# EAGLE design Adafruit QT Py ESP32 Pico (EAGLE 9.6.2)
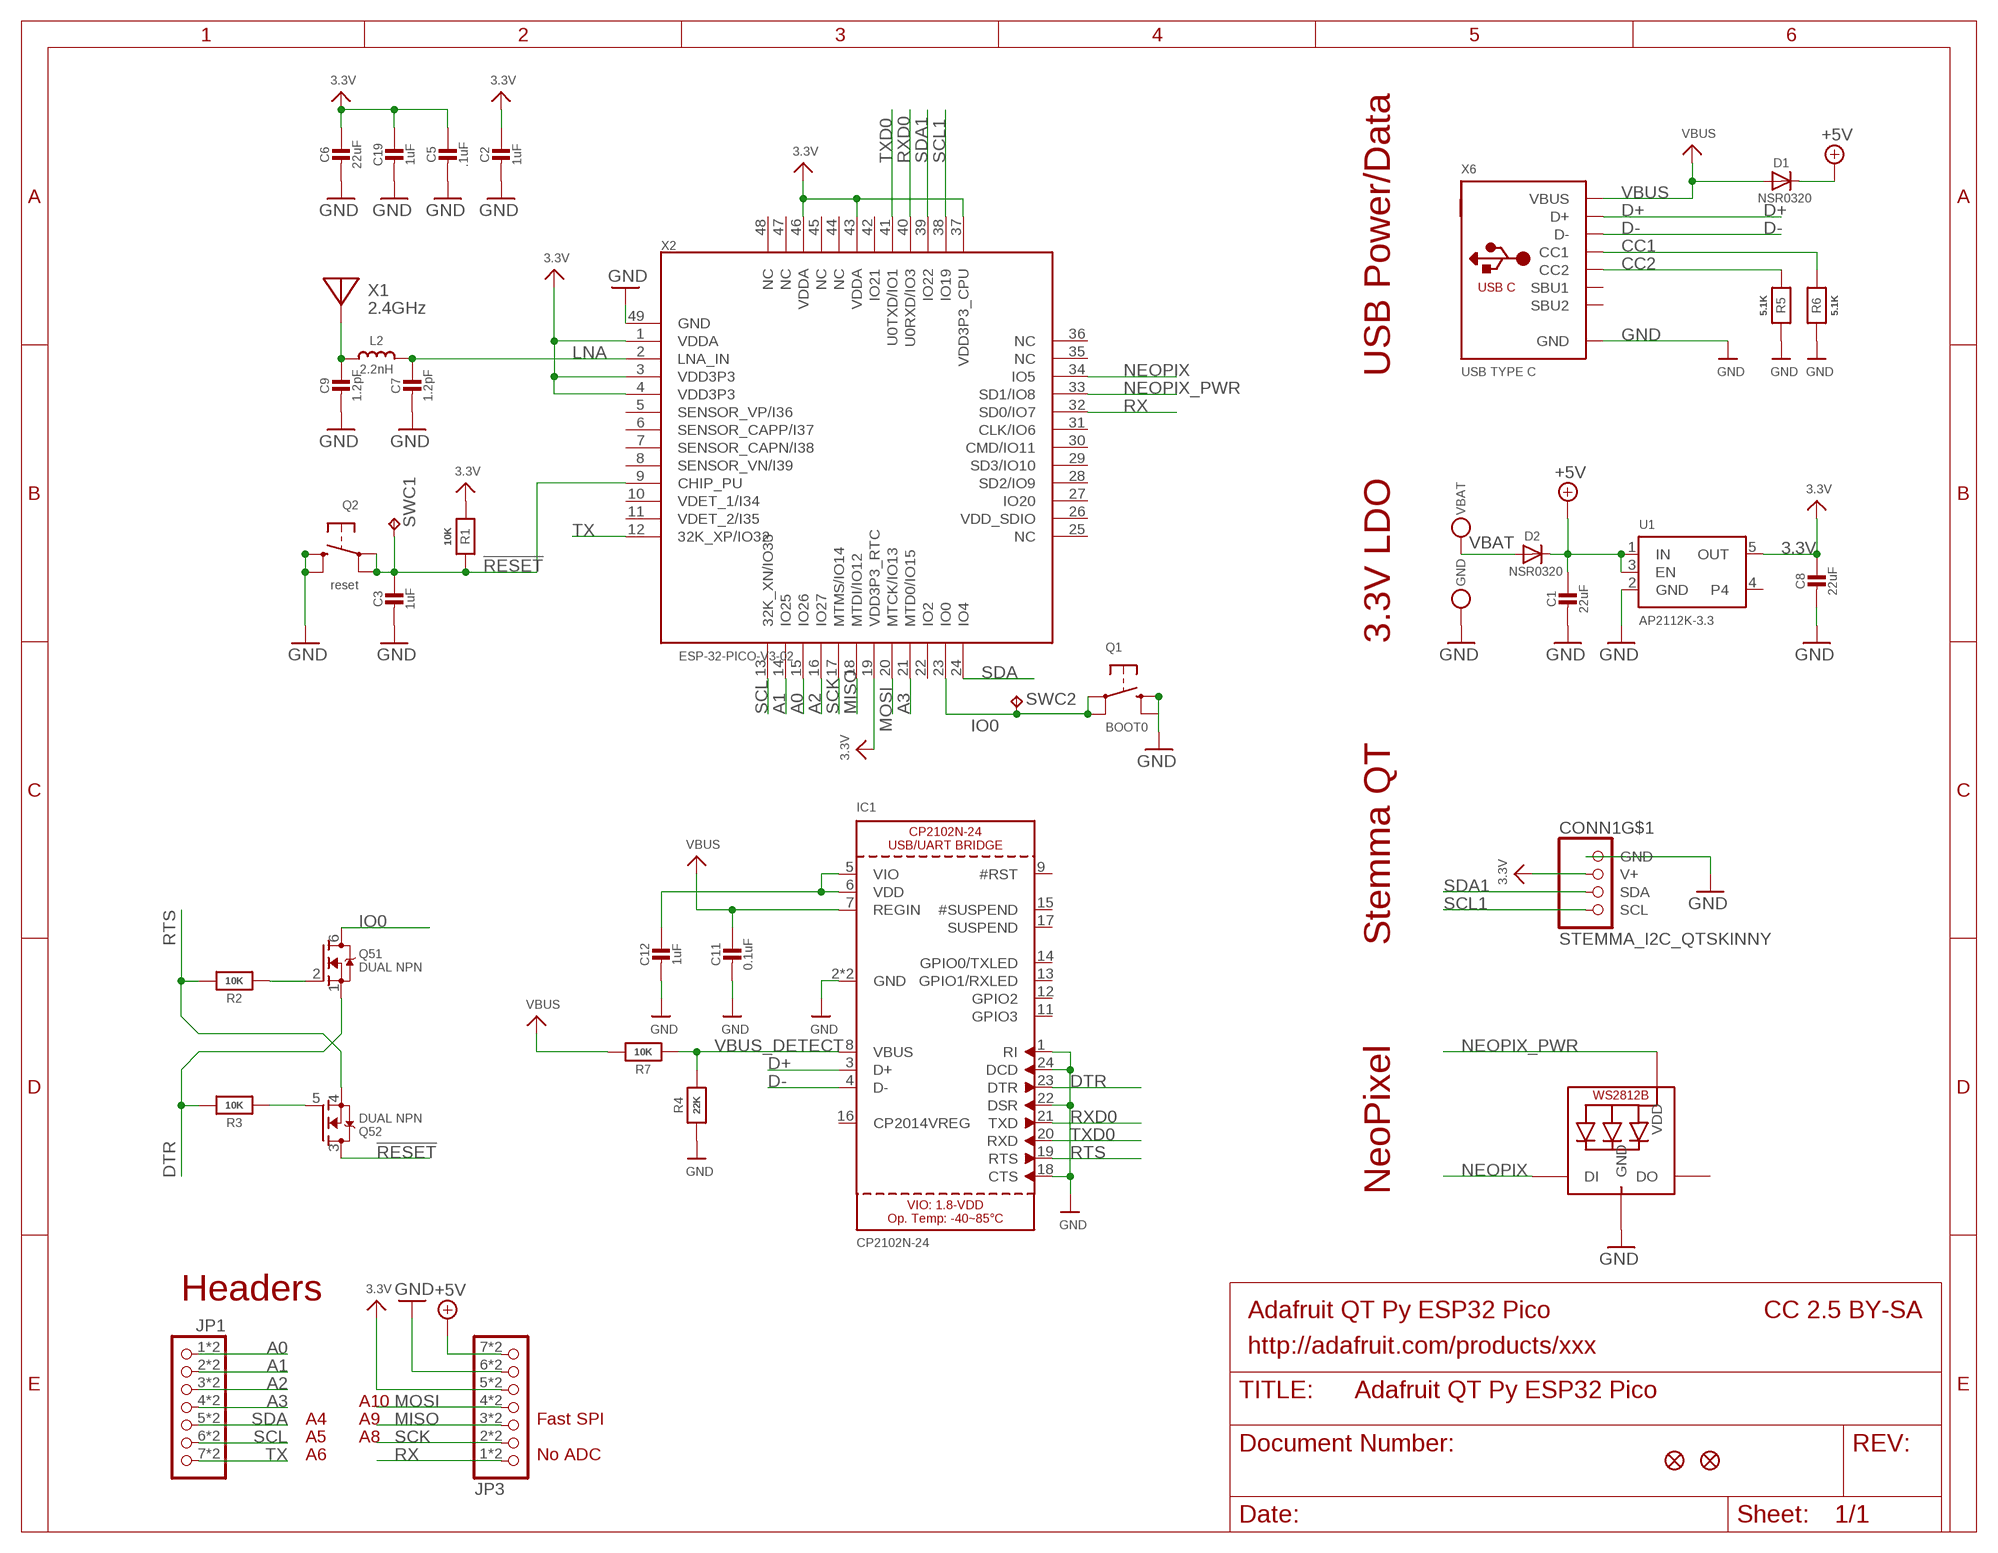
[diagram p0: schematic, sheet 1]

## Parts
C1  22uF  CAP_CERAMIC0805-NOOUTLINE  [0805-NO]
C2  1uF  CAP_CERAMIC_0402NO  [_0402NO]
C3  1uF  CAP_CERAMIC_0402NO  [_0402NO]
C5  .1uF  CAP_CERAMIC_0402NO  [_0402NO]
C6  22uF  CAP_CERAMIC0805-NOOUTLINE  [0805-NO]
C7  1.2pF  CAP_CERAMIC_0402NO  [_0402NO]
C8  22uF  CAP_CERAMIC0805-NOOUTLINE  [0805-NO]
C9  1.2pF  CAP_CERAMIC_0402NO  [_0402NO]
C11  0.1uF  CAP_CERAMIC_0402NO  [_0402NO]
C12  1uF  CAP_CERAMIC_0402NO  [_0402NO]
C19  1uF  CAP_CERAMIC_0603WIDE  [0603-NO_WIDE]
CONN1  STEMMA_I2C_QTSKINNY  [JST_SH4_SKINNY]
D1  NSR0320  DIODE_SOD323MINI  [SOD-323_MINI]
D2  NSR0320  DIODE_SOD323MINI  [SOD-323_MINI]
GND  TESTPOINT_MINUS  [TESTPOINT_MINUS_1X3MM]
IC1  CP2102N-24  [QFN24_4MM_SMSC]
JP1  HEADER-1X7_CASTEL  [1X07_CASTEL]
JP3  HEADER-1X7_CASTEL  [1X07_CASTEL]
L2  2.2nH  INDUCTOR_0402  [_0402]
LED1  WS2812B_SK6805_1515  [SK6805_1515]
Q1  BOOT0  SWITCH_TACT_SMT4.6X2.8  [BTN_KMR2_4.6X2.8]
Q2  reset  SWITCH_TACT_SMT4.6X2.8  [BTN_KMR2_4.6X2.8]
Q5  DUAL NPN  MOSFET-N_DUAL  [SOT363]
R1  10K  RESISTOR_0402NO  [_0402NO]
R2  10K  RESISTOR_0402NO  [_0402NO]
R3  10K  RESISTOR_0402NO  [_0402NO]
R4  22K  RESISTOR_0402NO  [_0402NO]
R5  5.1K  RESISTOR_0402NO  [_0402NO]
R6  5.1K  RESISTOR_0402NO  [_0402NO]
R7  10K  RESISTOR_0402NO  [_0402NO]
SWC1  TPB1,27  [B1,27]
SWC2  TPB1,27  [B1,27]
U1  AP2112K-3.3  VREG_SOT23-5  [SOT23-5]
U$6  FIDUCIAL_1MM  [FIDUCIAL_1MM]
U$8  FIDUCIAL_1MM  [FIDUCIAL_1MM]
VBAT  TESTPOINT_PLUS13  [TESTPOINT_PLUS_1X3MM]
X1  2.4GHz  ANTENNA_JOHANSON_2450AT18B100  [ANT_2450AT18B100]
X2  ESP-32-PICO-V3-02  [QFN48_7X7]
X6  USB TYPE C  USB_C  [USB_C_CUSB31-CFM2AX-01-X]

## Nets
3.3V [power]: C2.1 C5.1 C6.1 C8.1 C19.1 CONN1.2(V+) JP3.5 JP3.5C R1.1 U1.5(OUT) X2.1(VDDA) X2.3(VDD3P3) X2.4(VDD3P3) X2.19(VDD3P3_RTC) X2.37(VDD3P3_CPU) X2.43(VDDA) X2.46(VDDA)
!RESET: C3.1 Q2.A'(P1) Q2.A(P) Q5.3(2:D) R1.2 SWC1.TP X2.9(CHIP_PU)
+5V [power]: C1.1 D1.C D2.C JP3.7 JP3.7C U1.1(IN) U1.3(EN)
A0: JP1.1 JP1.1C X2.15(IO26)
A1: JP1.2 JP1.2C X2.14(IO25)
A2: JP1.3 JP1.3C X2.16(IO27)
A3: JP1.4 JP1.4C X2.21(MTD0/IO15)
CC1: R6.2 X6.A5(CC1)
CC2: R5.2 X6.B5(CC2)
D+: IC1.3(D+) X6.A6(D+) X6.B6(D+)
D-: IC1.4(D-) X6.A7(D-) X6.B7(D-)
DTR: IC1.23(DTR) Q5.1(1:S) R3.2
GND [power]: C1.2 C2.2 C3.2 C5.2 C6.2 C7.2 C8.2 C9.2 C11.2 C12.2 C19.2 CONN1.1(GND) GND.P$1 IC1.1(RI) IC1.2(GND) IC1.18(CTS) IC1.22(DSR) IC1.24(DCD) IC1.THERM(GND) JP3.6 JP3.6C LED1.4(GND) Q1.B'(S1) Q1.B(S) Q2.B'(S1) Q2.B(S) R4.1 R5.1 R6.1 U1.2(GND) X2.49(GND) X6.A1B12(GND) X6.B1A12(GND)
IO0: Q1.A'(P1) Q1.A(P) Q5.6(1:D) SWC2.TP X2.23(IO0)
LNA: C7.1 L2.2 X2.2(LNA_IN)
MISO: JP3.3 JP3.3C X2.18(MTDI/IO12)
MOSI: JP3.4 JP3.4C X2.20(MTCK/IO13)
N$1 [power]: C12.1 IC1.5(VIO) IC1.6(VDD)
N$3: C9.1 L2.1 X1.FP
N$12: Q5.5(2:G) R3.1
N$13: Q5.2(1:G) R2.1
NEOPIX: LED1.1(DI) X2.34(IO5)
NEOPIX_PWR: LED1.2(VDD) X2.33(SD1/IO8)
RTS: IC1.19(RTS) Q5.4(2:S) R2.2
RX: JP3.1 JP3.1C X2.32(SD0/IO7)
RXD0: IC1.21(TXD) X2.40(U0RXD/IO3)
SCK: JP3.2 JP3.2C X2.17(MTMS/IO14)
SCL: JP1.6 JP1.6C X2.13(32K_XN/IO33)
SCL1: CONN1.4(SCL) X2.38(IO19)
SDA: JP1.5 JP1.5C X2.24(IO4)
SDA1: CONN1.3(SDA) X2.39(IO22)
TX: JP1.7 JP1.7C X2.12(32K_XP/IO32)
TXD0: IC1.20(RXD) X2.41(U0TXD/IO1)
VBAT: D2.A VBAT.P$1
VBUS [power]: C11.1 D1.A IC1.7(REGIN) R7.2 X6.A4B9(VBUS) X6.B4A9(VBUS)
VBUS_DETECT: IC1.8(VBUS) R4.2 R7.1
Unconnected: CONN1.MT1(MT) CONN1.MT2(MT) IC1.9(#RST) IC1.11(GPIO3) IC1.12(GPIO2) IC1.13(GPIO1/RXLED) IC1.14(GPIO0/TXLED) IC1.15(#SUSPEND) IC1.16(CP2014VREG) IC1.17(SUSPEND) LED1.3(DO) U1.4 X2.5(SENSOR_VP/I36) X2.6(SENSOR_CAPP/I37) X2.7(SENSOR_CAPN/I38) X2.8(SENSOR_VN/I39) X2.10(VDET_1/I34) X2.11(VDET_2/I35) X2.22(IO2) X2.25(NC) X2.26(VDD_SDIO) X2.27(IO20) X2.28(SD2/IO9) X2.29(SD3/IO10) X2.30(CMD/IO11) X2.31(CLK/IO6) X2.35(NC) X2.36(NC) X2.42(IO21) X2.44(NC) X2.45(NC) X2.47(NC) X2.48(NC) X6.A8(SBU1) X6.B8(SBU2)

## Notes on the sheet
- USB Power/Data
- 3.3V LDO
- Stemma QT
- NeoPixel
- Headers
- Adafruit QT Py ESP32 Pico | CC 2.5 BY-SA
- http://adafruit.com/products/xxx
- A10
- A4 | A9 | Fast SPI
- A5 | A8
- A6 | No ADC

## Library data of the parts
C1-C3 C5-C9 C11 C12 C19 = microbuilder:CAP_CERAMIC: Ceramic Capacitors For new designs, use the packages preceded by an '_' character since they are more reliable: The following footprints should be used on most boards: _0402 - Standard footprint for regular board layouts _0603 - Standard footprint for regular board layouts _0805 - Standard footprint for regular board layouts _1206 - Standard footprint for regular board layouts For extremely tight-pitch boards where space is at a premium, the following 'micro-pitch' footprints can be used (smaller pads, no silkscreen outline, etc.): _0402MP - Micro-pitch footprint for very dense/compact boards _0603MP - Micro-pitch footprint for very dense/compact boards _0805MP - Micro-pitch footprint for very dense/compact boards _1206MP - Micro-pitch footprint for very dense/compact boards
CONN1 = microbuilder:STEMMA_I2C
D1 D2 = microbuilder:DIODE: Diode SMA Model Volts Amps Type Vf Ir Digikey # Notes SSA34-E3 40V 3A Schottky 480mV @ 3A 200uA @ 40V SSA34-E3/61TGITR-ND CDBA120-G 20V 1A Schottky 500mV @ 1A 500uA @ 20V 641-1014-6-ND REEL MBRA210 10V 2A Schottky 350mV @ 2A 700uA @ 10V MBRA210LT3 SOD-123 Model Volts Amps Type Vf Ir Order # Notes BAT54T1G 30V 200mA Schottky 800mV @ 200mA 2uA @ 25V BAT54T1GOSTR-ND B0530W 30V 500mA Schottky 430mV @ 500mA 130uA @ 30V B0530W-FDICT-ND REEL MBR120 20V 1A Schottky 340mV @ 1A MBR120VLSFT1GOSCT-ND SOD-323 Model Volts Amps Type Vf Ir Order # Notes PMEG2005EJ 20V 500mA Schottky 355mV @ 500mA 568-4110-1-ND ZLLS410 10V 570mA Schottky 380mV @ 570mA ZLLS410CT-ND 1N4148WS 75V 150mA Silicon/Simple 1V 1N4148WSFSCT-ND REEL SOD-523 Model Volts Amps Type Vf Ir Order # Notes BAT54XV2 30V 200mA Schottky 0.8V @ 100mA BAT54XV2CT-ND TB751S 30V 30mA Schottky RB751S-40TE61CT-ND SOT23-R/W (R = Solder Paste/Reflow Ovens, W = Hand-Soldering) Model Volts Amps Type Vf Ir Order # Notes BAT54FILM 40V 300mA Schottky 497-7162-1-ND POWERDI-5 Model Volts Amps Type Vf Ir Order # Notes PDS560 60V 5A Schottky 670mV @ 5A 150uA @ 60V PDS560DICT-ND
GND VBAT = microbuilder:TESTPOINT: Test Point Various test points for characterisation and PCB testing TESTPOINT_SMT - Compact Surface Mount Test Point [Digikey: 5016KTR-ND]
IC1 = microbuilder:CP2102N-24
JP1 JP3 = microbuilder:HEADER-1X7: PIN HEADER
L2 = microbuilder:INDUCTOR: Inductors 0603: 10nH Ceramic Inductor - microwire antenna/RF (Digikey: 712-1434-2-ND) 0805: 560nH Ceramic Inductor - RF (Digikey: 553-1047-1-ND) 270nH Ceramic Inductor - Q = 40@250MHz, +-5%, 1 Ohm DC Resistance (Digikey: 535-10506-2-ND) 1007 (2518 Metric) SMT: 10µH 10% 250mOhm 820mA 1007 Inductor (Digikey: 587-2189-1-ND) 22µH 10% 500mOhm 580mA 1007 Inductor (Digikey: 587-2190-1-ND) 47µH 10% 950mOhm 420mA 1007 Inductor (Digikey: 587-2191-1-ND) 47µH 5% 100mOhm 1A 1008 Inductor (Digikey: 732-1816-1-ND) 5.0x5.0mm (Taiyo Yuden NR5040 Series) 6.8µH 20% 2.3A 64mOhm Inductor (Digikey: 587-2374-2-ND) 5.0x5.0mm (TDK VLC5045 Series) 4.7µH 20% 3.3A 34mOhm Inductor (Digikey: 445-6526-1-ND) 6.8µH 20% 2.7A 46mOhm Inductor (Digikey: 445-6527-1-ND) 6.0x6.0mm (TDK VLC6045 Series) 4.7µH 20% 3.8A 27mOhm Inductor (Digikey: 445-6538-2-ND) 6.8µH 20% 3A 41mOhm Inductor (Digikey: 445-6540-1-ND) 6.2µH 30% 2.2A 45mOhm Inductor (Digikey: SRR5028-6R2YCT-ND) - Not TDK VLC6045 but footprint should match 6.0x6.0mm (TDK SLF6045 Series) 6.8uH 30% 2A 33mOhm Inductor (Digikey: 445-4572-1-ND, Mouser: 810-SLF645T6R8N2R0PF) 6.0x6.0mm (Sumida CDRH5D28 Series) 6.2uH 30% 1.8A 45mOhm Inductor (Digikey: 308-1542-1-ND) Taiyo Yuden NR3015T2R2M - 2.2uH 20% 1.5A (Digikey: 587-1648-2-ND, Mouser: 963-NR3015T2R2M) - Used with TI TPS62172 CoilCraft RFID Transponder Coil - MA5532-AE (For use with AS3935 Lightning Sensor) Taiyo Yuden NRH2412T2R2MNGH - 2.2uH 20% 1AA (Digikey: 587-3443-1-ND) - Used with TI LM3671 Vishay IHLP 1.0uH Molded Inductor - 24mOhm DCR, 5A, +/-20%, -55°C-125°C (Digikey: 541-1319-1-ND)
LED1 = microbuilder:WS2812B
Q1 Q2 = microbuilder:SWITCH_TACT_SMT: SMT Tact Switches 6x6mm - Digikey: P12940SCT-ND KMR2 (4.6x2.8mm) - Digikey: 401-1426-1-ND EVQ-PQHB55 - Light Touch, 160GF (4.5x4.5mm) - Digikey: P8090SCT-ND KMT0 - KMT021 NGJ LHS (etc.) IP68/Waterproof - Digikey: CKN10289CT-ND
Q5 = microbuilder:MOSFET-N_DUAL: Dual N-Channel MOSFET SOT363 (2.0x1.25mm) 2N7002PS - 60V, 320mA [Digikey: 568-5984-1-ND]
R1-R7 = microbuilder:RESISTOR: Resistors For new designs, use the packages preceded by an '_' character since they are more reliable: The following footprints should be used on most boards: _0402 - Standard footprint for regular board layouts _0603 - Standard footprint for regular board layouts _0805 - Standard footprint for regular board layouts _1206 - Standard footprint for regular board layouts For extremely tight-pitch boards where space is at a premium, the following 'micro-pitch' footprints can be used (smaller pads, no silkscreen outline, etc.): _0402MP - Micro-pitch footprint for very dense/compact boards _0603MP - Micro-pitch footprint for very dense/compact boards _0805MP - Micro-pitch footprint for very dense/compact boards _1206MP - Micro-pitch footprint for very dense/compact boards
SWC1 SWC2 = testpad:TP: Test pad
U1 = adafruit_power:VREG_SOT23-5: SOT23-5 Fixed Voltage Regulators Part Current Out V Out V In V Dropout θJA (°C/W) TJ (°C) Digikey Part No. ADP121 150mA 3.3V 3.4-5.5V 0.09V @ 150mA -- -- ADP121-AUJZ33R7CT-ND ADP121 150mA 3.0V 3.1-5.5V 0.09V @ 150mA -- -- ADP121-AUJZ30R7CT-ND ADP122 300mA 3.3V 3.4-5.5V 0.085V @ 300mA -- -- ADP122AUJZ-3.3-R7CT-ND ADP1712 300mA 3.3V 3.5-5.5V 0.17V @ 300mA -- -- ADP1712AUJZ-3.3-R7TR-ND AP7311 (Low Cost) 150mA 3.3V 3.5-6V 0.15V @ 150mA -- -- AP7311-33WG-7DICT-ND LD39015M18R 150mA 1.8V 1.9V-5.5V 0.08V @ 100mA -- -- 497-6977-1-ND LP2985A-33DBVR 150mA 3.3V 3.3-16V 0.28V @ 150mA 206 150 296-18479-1-ND MCP1824T-3302E/OT 300mA 3.3V 3.5V-6V 0.2V @ 300mA -- -- MCP1824T-3302E/OTCT-ND MIC5205-2.5YM5 TR 150mA 2.5V 2.7-16V 0.165V @ 150mA -- -- 576-1257-2-ND MIC5205-3.0YM5 TR 150mA 3.0V 3.2V-16V 0.165V @ 150mA -- -- 576-1258-2-ND MIC5205-3.3YM5 TR 150mA 3.3V 3.5V-16V 0.165V @ 150mA -- -- 576-1259-2-ND TPS780330220 150mA 3.3V+2.2V 3.6-5.5V 250mV Max -- -- 296-23332-1-ND TDA3663/N1,135 100mA 3.3V 3.5-45V 0.18V @ 50mA -- -- 568-5343-1-ND Max operating temp can be calculated using θJA, TJ (max junction temperature), and power in watts. Set the "Maximum Ambient Temperature" until it reaches TJ ("Max Junction Temperature"), which is the absolute limit for safe use of the regulator: Heat Sink Temperature Calculator <http://www.daycounter.com/Calculators/Heat-Sink-Temperature-Calculator.phtml> For example, With 12V source into a 3.3V LP2985 and a 30mA load, we are dissipating (12V-3.3V) * 0.03A = 0.261W. With a θJA of 206 °C/W, a TJ of 150°C, and 261mW we can safely use the chip without a heat sink up to 75°C (=147.1°C Junction Temperature).
U$6 U$8 = microbuilder:FIDUCIAL: Fiducial Alignment Points Various fiducial points for machine vision alignment.; BOM: EXCLUDE
X1 = adafruit_wireless:ANTENNA_JOHANSON_2450AT18B100: Johanson 2.4GHz Chip Antenna (1206 Package) Frequency Range: 2400 - 2500 Mhz Peak Gain 0.5 dBi typ. (XZ-V) Average Gain -0.5 dBi typ. (XZ-V) Input Power 3W max. Operating Temperature -40 to +85°C Digikey: 712-1006-1-ND
X2 = adafruit_wireless:ESP-32-PICO-V3-02
X6 = adafruit_electromech:USB_C: USB Type-C USB 2.0 Connector

## Net classes
1 power: width 0.254 mm
2 gnd: width 0.254 mm

## Board
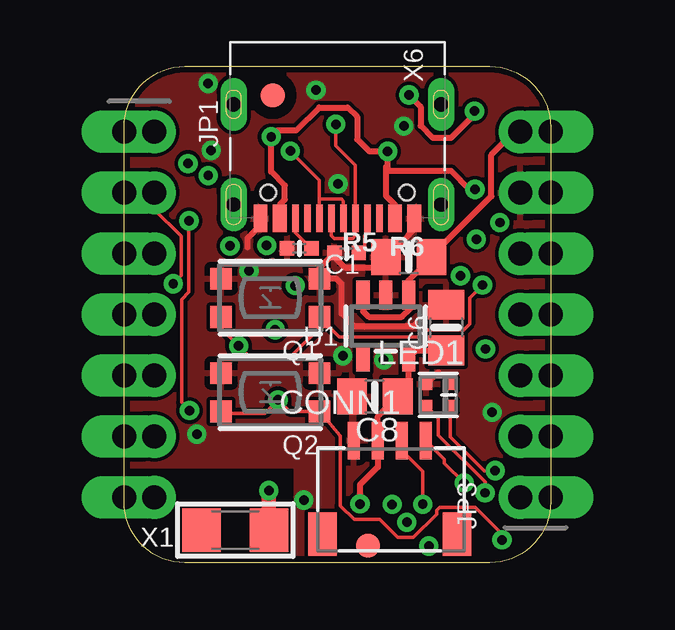
[diagram p1: board, top side]
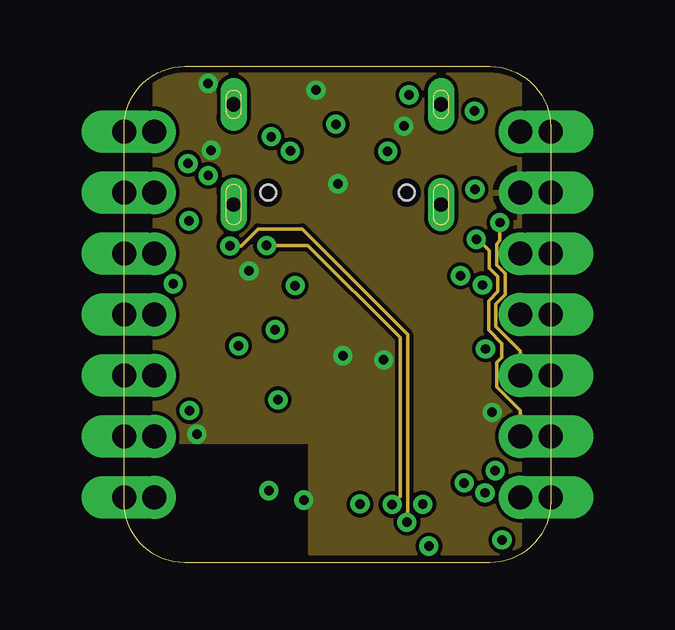
[diagram p2: board, inner layer Route2]
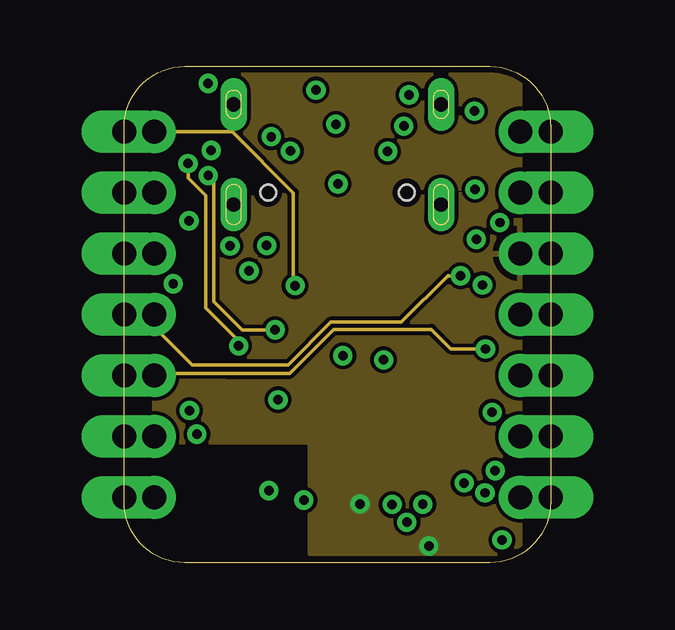
[diagram p3: board, inner layer Route15]
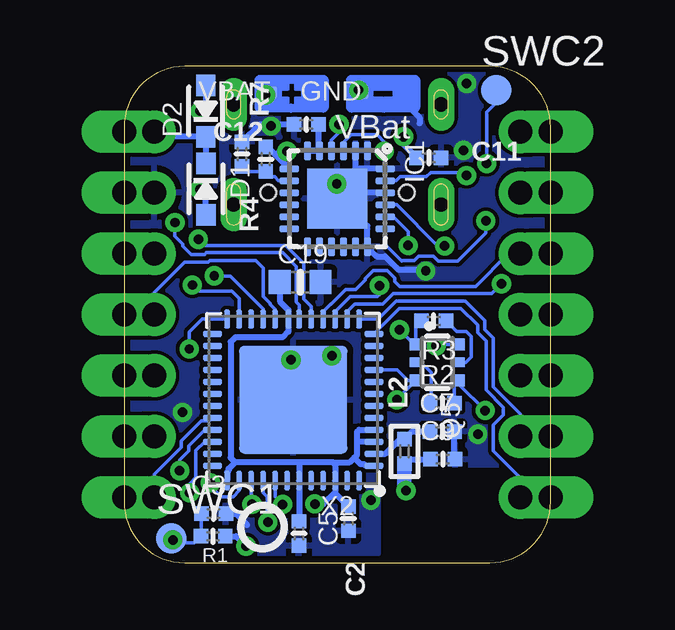
[diagram p4: board, bottom side, seen from below]

Size 17.78 x 20.7 mm. Coordinates in mm from the lower left corner, seen from the top.
Outline: 17.78,18.16 17.78,2.54 arc-90 15.24,0 2.54,0 arc-90 0,2.54 0,18.16 arc-90 2.54,20.7 15.24,20.7 arc-90 17.78,18.16
Copper layers (1+2*15+16): Top 0.035mm / dielectric 0.25mm / Route2 0.035mm / dielectric 0.15mm / Route15 0.035mm / dielectric 0.2mm / Bottom 0.035mm
Design rules "adafruit 6-6 *": minimum track width 6mil, minimum drill 15.5mil, track to track 6mil, track to pad 6mil, pad to pad 6mil, via to via 6mil, smd to smd 6mil, copper to edge 10mil, drill to drill 8mil, minimum pad ring 10mil, minimum via ring 8mil, stop-mask expansion 2mil, vias tented up to drill 20mil, thermal gap 10mil

### Footprints (pad centres in the part's own frame; a part is rotated, then mirrored left to right if it is on the bottom)
0805-NO = smd 1.24 x 1.5: 1 -0.95,0; 2 0.95,0
_0402NO = smd 0.6 x 0.6: 1 -0.508,0; 2 0.508,0
0603-NO_WIDE = smd 0.9 x 1: 1 -0.85,0; 2 0.85,0
JST_SH4_SKINNY = smd 0.5 x 1.55: 1 -1.5,2.514; 2 -0.5,2.514; 3 0.5,2.514; 4 1.5,2.514 | smd 1.2 x 1.8: MT1 -2.8,-1.386; MT2 2.8,-1.386
SOD-323_MINI = smd 0.9 x 0.8: A 1.07,0; C -1.07,0
TESTPOINT_MINUS_1X3MM = smd 0.5 x 0.5: P$1 0.85,-0.05
QFN24_4MM_SMSC = smd 0.8 x 0.28: 1 -2,1.25; 2 -2,0.75; 3 -2,0.25; 4 -2,-0.25; 5 -2,-0.75; 6 -2,-1.25; 13 2,-1.25; 14 2,-0.75; 15 2,-0.25; 16 2,0.25; 17 2,0.75; 18 2,1.25 | smd 0.28 x 0.8: 7 -1.25,-2; 8 -0.75,-2; 9 -0.25,-2; 10 0.25,-2; 11 0.75,-2; 12 1.25,-2; 19 1.25,2; 20 0.75,2; 21 0.25,2; 22 -0.25,2; 23 -0.75,2; 24 -1.25,2 | smd 2.5 x 2.5: THERM 0,0
1X07_CASTEL = drill 1 pad 1.778: 1 -7.62,0; 2 -5.08,0; 3 -2.54,0; 4 0,0; 5 2.54,0; 6 5.08,0; 7 7.62,0 | drill 1 pad 1.778 long: 1C -7.62,-1.27; 2C -5.08,-1.27; 3C -2.54,-1.27; 4C 0,-1.27; 5C 2.54,-1.27; 6C 5.08,-1.27; 7C 7.62,-1.27
_0402 = smd 0.6 x 0.6: 1 -0.508,0; 2 0.508,0
SK6805_1515 = smd 0.5 x 0.5: 1 -0.5,-0.45; 2 0.5,-0.45; 3 0.5,0.45; 4 -0.5,0.45
BTN_KMR2_4.6X2.8 = smd 0.9 x 0.9: A 2.05,0.8; A' -2.05,0.8; B 2.05,-0.8; B' -2.05,-0.8
SOT363 = smd 0.5 x 0.5: 1 -0.75,-0.9; 3 0.75,-0.9; 4 0.75,0.9; 6 -0.75,0.9 | smd 0.4 x 0.5: 2 0,-0.9; 5 0,0.9
B1,27 = smd 1.27 x 1.27: TP 0,0
SOT23-5 = smd 0.55 x 1.2: 1 -0.95,-1.3; 2 0,-1.3; 3 0.95,-1.3; 4 0.95,1.3; 5 -0.95,1.3
FIDUCIAL_1MM = smd 1 x 1: 1 0,0
TESTPOINT_PLUS_1X3MM = smd 0.5 x 0.5: P$1 0.85,-0.05
ANT_2450AT18B100 = smd 1.6 x 1.8: FP -1.4,0; NC 1.4,0
QFN48_7X7 = smd 0.8 x 0.25: 1 -3.365,2.75; 2 -3.365,2.25; 3 -3.365,1.75; 4 -3.365,1.25; 5 -3.365,0.75; 6 -3.365,0.25; 7 -3.365,-0.25; 8 -3.365,-0.75; 9 -3.365,-1.25; 10 -3.365,-1.75; 11 -3.365,-2.25; 12 -3.365,-2.75; 25 3.365,-2.75; 26 3.365,-2.25; 27 3.365,-1.75; 28 3.365,-1.25; 29 3.365,-0.75; 30 3.365,-0.25; 31 3.365,0.25; 32 3.365,0.75; 33 3.365,1.25; 34 3.365,1.75; 35 3.365,2.25; 36 3.365,2.75 | smd 0.25 x 0.8: 13 -2.75,-3.365; 14 -2.25,-3.365; 15 -1.75,-3.365; 16 -1.25,-3.365; 17 -0.75,-3.365; 18 -0.25,-3.365; 19 0.2,-3.365; 20 0.75,-3.365; 21 1.25,-3.365; 22 1.75,-3.365; 23 2.25,-3.365; 24 2.75,-3.365; 37 2.75,3.365; 38 2.25,3.365; 39 1.75,3.365; 40 1.25,3.365; 41 0.75,3.365; 42 0.25,3.365; 43 -0.25,3.365; 44 -0.75,3.365; 45 -1.25,3.365; 46 -1.75,3.365; 47 -2.25,3.365; 48 -2.75,3.365 | smd 4.5 x 4.5: 49 0,0
USB_C_CUSB31-CFM2AX-01-X = smd 0.575 x 1.15: A1B12 -3.2,3.545; A4B9 -2.4,3.545; B1A12 3.2,3.545; B4A9 2.4,3.545 | smd 0.275 x 1.15: A5 -1.25,3.545; A6 -0.25,3.545; A7 0.25,3.545; A8 1.25,3.545; B5 1.75,3.545; B6 0.75,3.545; B7 -0.75,3.545; B8 -1.75,3.545 | drill 0.6 pad 1 long: M1 -4.32,2.97; M2 4.32,2.97; M3 -4.32,-1.21; M4 4.32,-1.21 | hole 0.65: 2.89,2.47; -2.89,2.47

### Placement (x,y rotation side)
C1  11.86,12.74 180 top
C2  8.43,1.84 270 bottom
C3  14.05,2.04 0 bottom
C5  10.49,1.22 270 bottom
C6  13.42,9.8 90 top
C7  4.52,5.47 0 bottom
C8  10.45,6.93 180 top
C9  4.5,4.32 0 bottom
C11  5.08,16.89 0 bottom
C12  10.19,18.28 180 bottom
C19  10.44,11.7 0 bottom
CONN1  11.07,2.58 0 top
D1  14.36,15.58 270 bottom
D2  14.38,18.83 90 bottom
GND  6.99,19.56 180 bottom
IC1  8.89,15.18 270 bottom
JP1  1.27,10.35 270 top
JP3  16.51,10.35 90 top
L2  6.1,4.65 90 bottom
LED1  13.09,7 0 top
Q1  6.1,11.05 180 top
Q2  6.1,7.11 180 top
Q5  4.72,8.36 270 bottom
R1  14.07,1.1 180 bottom
R2  4.52,6.65 0 bottom
R3  4.88,10.08 180 bottom
R4  12.87,17.04 270 bottom
R5  7.3,13.11 0 top
R6  9.27,12.93 0 top
R7  11.87,16.83 90 bottom
SWC1  15.81,1.02 0 bottom
SWC2  2.26,19.7 0 bottom
U1  10.91,9.87 180 top
U$3  [QTPY_ESP32_BOT]  17.78,0 0 bottom
U$6  6.2,19.49 0 top
U$8  10.16,0.71 0 top
U$12  [PCBFEAT-REV-040]  12.01,1.49 0 bottom
U$22  [QTPY_ESP32_TOP]  0,0 0 top
VBAT  10.79,19.56 180 bottom
X1  4.64,1.36 180 top
X2  10.73,6.79 180 bottom
X6  8.89,17.91 180 top

### Tracks (layer width: path | path; a pad name or v marks a point on that pad's centre or on a via)
3.3V  (via drill 0.39)
  Top 0.254: C6.1 12.15,8.85 U1.5 11.86,7.39 C8.1 10.57,6.11 CONN1.2 10.57,4 9.83,3.25 v9.83,2.45
  Bottom 0.254: X2.46 8.98,2.94 9.47,2.45 v9.83,2.45 | C2.1 8.98,2.9 X2.46 | X2.46 8.98,4.09 9.08,4.19 | 10.41,4.19 10.48,4.12 X2.43 C5.1 | 9.08,4.19 10.41,4.19 | 9.08,4.19 8.38,4.19 8.19,4.38 | 8.06,5.02 8.06,4.51 8.19,4.38 | 8.06,5.02 8.06,5.46 7.98,5.54 X2.4 | X2.3 8.04,5.04 8.06,5.02 | X2.1 7.71,4.04 7.78,4.11 7.92,4.11 8.19,4.38 | 10.41,4.19 13.14,4.19 | X2.37 13.48,3.78 13.42,3.84 13.42,3.92 13.14,4.19 | 13.14,4.19 13.34,4.38 13.34,9.21 13.14,9.4 11.18,9.4 10.93,9.64 X2.19 10.93,10.54 11.29,10.9 C19.1 | JP3.5C JP3.5 | R1.1 13.11,1.1 v12.7,0.7
  pour Route15: 1.27,5.02 7.75,5.02 7.75,0.38 16.51,0.38 16.51,20.7 1.27,20.7
!RESET  (via drill 0.39)
  Top 0.152: Q2.A 4.12,6.24 5.86,6.24 v6.41,6.79 6.9,6.31 Q2.A' 9.01,5.28 9.01,2.38 9.59,1.8 10.66,1.8 11.4,1.06 12.06,1.06 13.03,2.03 13.03,2.18 13.17,2.32 14.63,2.32 15.75,1.21 v15.75,0.95
  Bottom 0.152: C3.1 14.55,1.13 R1.2 14.86,0.83 15.62,0.83 v15.75,0.95 SWC1.TP | X2.9 6.39,8.04 5.96,7.61 Q5.3 6.41,6.82 v6.41,6.79
+5V
  Top 0.254: U1.3 9.96,10.49 10.2,10.25 11.58,10.25 11.94,10.6 11.94,11.09 U1.1 11.86,11.79 C1.1 12.81,12.79 15.3,15.28 15.3,17.02 16.26,17.97 JP3.7
  Bottom 0.254: D1.C 14.38,16.67 D2.C 15.91,17.76 16.12,17.97 JP3.7 JP3.7C
A0  (via drill 0.39)
  Route15 0.152: v7.13,11.56 7.06,11.63 7.06,15.42 4.51,17.97 JP1.1
  Bottom 0.152: v7.13,11.56 7.13,11.18 7.22,11.09 8.36,11.09 8.98,10.47 X2.15
  Bottom 0.254: JP1.1C JP1.1
A1  (via drill 0.39)
  Top 0.152: v2.05,11.63 2.39,11.97 2.39,13.61 1.27,14.73 JP1.2
  Bottom 0.152: X2.14 8.48,10.47 8.16,10.79 6.99,10.79 6.56,11.22 2.46,11.22 v2.05,11.63
  Bottom 0.254: JP1.2C JP1.2
A2
  Bottom 0.152: X2.16 9.48,10.47 9.16,10.79 9.15,10.79 8.54,11.4 8.13,11.4 7.73,11.79 7.73,11.84 7.39,12.19 6.82,12.19 6.5,11.87 6.5,11.73 6.3,11.53 3.13,11.53 1.76,12.89 JP1.3
  Bottom 0.254: JP1.3C JP1.3
A3  (via drill 0.39)
  Route15 0.152: v14.02,11.96 13.51,11.96 13.5,11.98 11.56,10.03 8.61,10.03 6.83,8.26 2.84,8.26 1.27,9.83 JP1.4
  Bottom 0.152: X2.21 11.98,10.59 13.36,11.96 v14.02,11.96
  Bottom 0.254: JP1.4C JP1.4
CC1
  Top 0.152: X6.A5 10.14,13.76 10.03,13.65 10.03,13.18 R6.2
CC2
  Top 0.152: X6.B5 7.14,13.78 R5.2
D+  (via drill 0.39)
  Top 0.152: v6.93,17.17 8.14,15.96 8.14,15.16 | X6.B6 8.14,15.16 | X6.A6 9.14,15.09 9.07,15.17 8.41,15.17 8.41,15.16 8.14,15.16
  Bottom 0.152: IC1.3 8.64,17.52 8.32,17.84 7.24,17.84 6.93,17.54 v6.93,17.17
D-  (via drill 0.39)
  Top 0.152: X6.A7 8.64,13.65 8.76,13.53 9.53,13.53 9.64,13.64 X6.B7 9.64,16.58 8.82,17.4 v8.82,18.29
  Bottom 0.152: v8.82,18.29 8.82,17.94 9.14,17.62 IC1.4
DTR  (via drill 0.39)
  Route15 0.152: v3.51,16.15 3.74,15.92 3.74,10.9 4.93,9.72 v6.3,9.72
  Bottom 0.152: R3.2 5.62,9.84 Q5.1 5.69,9.11 v6.3,9.72 | v3.51,16.15 3.64,16.27 5,16.27 5.18,16.09 6.27,16.09 6.44,15.93 IC1.23
GND  (via drill 0.39)
  Top 0.254: X6.A1B12 12.09,13.92 11.86,13.69 11.86,13.67 10.92,12.74 C1.2 10.47,12.29 9.22,12.29 8.67,12.84 | R6.1 8.67,12.84 | 8.67,12.84 8.23,12.39 8.2,12.39 8.15,12.34 Q1.B' 8.85,11.85 9.07,11.63 9.07,10.39 9.6,9.86 10.02,9.86 10.03,9.84 12.03,9.84 12.94,10.75 C6.2 | LED1.4 13.1,7.96 13.11,7.96 | X6.B1A12 5.69,14.07 5.14,13.53 5.14,13.14
  Bottom 0.254: C7.2 4.04,5.45 4.04,4.37 C9.2 | IC1.2 8.14,16.27 | v8.91,15.8 8.61,15.8 8.14,16.27 | IC1.22 8.64,15.43 IC1.THERM 8.78,15.18 7.64,14.04 IC1.18 7.24,12.78 6.9,12.78 6.35,12.22 5.27,12.22 v5.21,12.17 | IC1.24 7.98,16.43 8.14,16.27 | C12.2 12.14,18.27 R4.1 | C3.2 13.12,2.04 12.65,1.57 | GND.P$1 7.94,19.71 v8,19.71 7.34,19.05 5.94,19.05 5.46,18.57 5.46,18.31
  other vias: 10.82,8.46 9.12,8.64 3.63,17.2 11.66,18.21 7.49,2.62 3.04,5.36 3.51,19.99 15.34,6.27
  pour Top: 0,4.01 7.16,4.01 7.16,0.38 17.78,0.38 17.78,20.7 0,20.7
  pour Bottom: 0,4.06 7.16,4.06 7.16,0.38 17.78,0.38 17.78,20.7 0,20.7
  pour Route2 (rank 4): 1.27,20.7 16.51,20.7 16.51,0.38 7.75,0.38 7.75,5.02 1.27,5.02
IO0  (via drill 0.39)
  Top 0.152: Q1.A 4.05,9.77 v4.78,9.04 5.18,8.64 6.99,8.64 8.15,9.8 Q1.A' 8.97,9.42 12.3,9.42 12.58,9.7 14.15,9.7 14.4,9.96 14.4,11.05 v14.94,11.58
  Route15 0.152: v4.78,9.04 4.78,9.25 3.4,10.62 3.4,15.3 2.67,16.04 v2.67,16.65
  Bottom 0.152: v4.78,9.04 4.71,9.11 Q5.6 | v2.67,16.65 2.67,18.78 2.26,19.19 SWC2.TP | v14.94,11.58 14.68,11.33 13.28,11.33 12.98,11.03 X2.23
LNA
  Bottom 0.254: X2.2 6.89,4.54 6.27,5.16 L2.2 5.78,5.47 C7.1
MISO  (via drill 0.39)
  Route2 0.152: JP3.3 16.51,8.83 15.49,9.84 15.49,10.79 15.88,11.18 15.88,12.06 15.53,12.41 15.53,13.3 15.66,13.43 v15.66,14.19
  Bottom 0.152: v15.66,14.19 15.66,13.63 15.33,13.3 15.33,13.2 14.98,12.86 14.42,12.86 14.35,12.93 11.18,12.93 10.61,12.36 10.61,10.87 10.48,10.74 X2.18
  Bottom 0.254: JP3.3C JP3.3
MOSI
  Bottom 0.152: JP3.4 16.51,11.28 15.24,12.55 14.28,12.55 14.21,12.61 12.28,12.61 11.97,12.3 11.97,11.1 11.68,10.81 11.68,10.76 11.48,10.57 X2.20
  Bottom 0.254: JP3.4C JP3.4
N$1
  Bottom 0.254: IC1.5 IC1.6 9.78,17.18 9.68,17.28 C12.1
N$3  (via drill 0.39)
  Top 0.61: v6.03,3.01 v6.04,3.01 X1.FP
  Bottom 0.254: L2.1 5.92,4.32 C9.1 | v6.03,3.01 6.1,3.07
  Bottom 0.61: 6.1,3.07 L2.1
N$12
  Bottom 0.152: Q5.5 3.54,8.36 3.31,8.59 3.31,9.44 3.52,9.64 3.92,9.64 R3.1
N$13
  Bottom 0.152: R2.1 4.98,6.71 4.98,7.93 5.41,8.36 Q5.2
NEOPIX  (via drill 0.39)
  Top 0.152: v15.04,2.91 15.04,3.37 13.1,5.31 13.1,6.04 LED1.1
  Bottom 0.152: X2.34 14.43,5.04 14.78,4.69 14.78,3.56 15.04,3.29 v15.04,2.91
NEOPIX_PWR  (via drill 0.39)
  Top 0.152: v15.46,3.84 15,3.84 13.59,5.25 LED1.2
  Bottom 0.152: X2.33 14.41,5.54 15.09,4.86 15.09,4.67 15.46,4.3 v15.46,3.84
RTS  (via drill 0.39)
  Top 0.152: v2.73,6.35 2.4,6.68 2.4,10.99 2.71,11.29 v2.71,14.26
  Bottom 0.152: R2.2 4.01,7.42 Q5.4 3.82,7.44 v2.73,6.35 | IC1.19 6.89,13.27 6.21,12.58 6.18,12.6 5.68,12.6 5.49,12.79 4.89,12.79 4.68,12.58 3.88,12.58 2.71,13.75 v2.71,14.26
RX
  Bottom 0.152: X2.32 14.22,5.92 14.55,5.92 15.39,5.08 15.39,4.8 16.51,3.68 16.51,2.86 JP3.1
  Bottom 0.254: JP3.1C 16.64,2.73 16.51,2.86
RXD0  (via drill 0.39)
  Route2 0.152: v11.79,1.69 11.79,1.77 11.81,1.79 11.81,9.52 7.42,13.92 5.59,13.92 4.88,13.21 v4.42,13.21
  Bottom 0.152: X2.40 11.98,2.91 11.82,2.75 11.82,1.72 v11.79,1.69 | IC1.21 6.42,14.93 4.7,13.21 v4.42,13.21
SCK  (via drill 0.39)
  Route2 0.152: JP3.2 16.51,6.35 15.53,7.33 15.53,8.35 15.75,8.56 15.75,9.14 15.19,9.7 15.19,10.92 15.57,11.3 15.57,11.94 15.22,12.29 15.22,13.02 14.76,13.49 v14.68,13.49
  Bottom 0.152: X2.17 9.98,10.69 10.29,11 10.29,12.47 11.05,13.23 14.43,13.23 v14.68,13.49
  Bottom 0.254: JP3.2C JP3.2
SCL
  Bottom 0.152: X2.13 7.19,10.16 6.43,10.92 3.56,10.92 2.74,10.1 2.74,9.73 2.39,9.37 2.39,7.33 1.27,6.21 JP1.6
  Bottom 0.254: JP1.6C JP1.6
SCL1  (via drill 0.39)
  Top 0.152: v14.17,3.33 13.35,4.15 13.35,4.32 CONN1.4
  Bottom 0.152: X2.38 12.98,3.01 13.24,2.76 13.73,2.76 14.17,3.2 v14.17,3.33
SDA  (via drill 0.39)
  Route15 0.152: v15.06,8.91 13.62,8.91 12.8,9.73 8.74,9.73 6.91,7.9 4.93,7.9 4.27,7.9 1.36,7.9 JP1.5
  Bottom 0.152: X2.24 14.53,10.16 15.06,9.63 v15.06,8.91
  Bottom 0.254: JP1.5C JP1.5
SDA1  (via drill 0.39)
  Top 0.152: v12.45,2.44 12.45,3.81 11.57,4.68 CONN1.3
  Bottom 0.152: X2.39 12.48,2.47 v12.45,2.44
TX
  Bottom 0.152: X2.12 6.3,10.61 3.74,10.61 3.05,9.92 3.05,9.6 2.69,9.25 2.69,7.2 1.98,6.48 1.98,6.17 2.39,5.75 2.39,4.66 1.27,3.54 JP1.7
  Bottom 0.254: JP1.7C JP1.7
TXD0  (via drill 0.39)
  Route2 0.152: v11.17,2.43 11.51,2.77 11.51,9.38 7.66,13.23 v5.94,13.23
  Bottom 0.152: X2.41 11.48,2.75 v11.17,2.43 | IC1.20 6.57,14.43 5.94,13.8 v5.94,13.23
VBAT  (via drill 0.39)
  Top 0.254: v14.61,18.83 14.61,18.71 13.61,17.72 12.87,17.72 12.36,18.22 12.36,19.02 v11.87,19.51
  Bottom 0.254: D2.A 14.38,19.06 v14.61,18.83 | v11.87,19.51 11.84,19.51 VBAT.P$1
VBUS  (via drill 0.39)
  Top 0.254: X6.A4B9 11.29,14.93 10.92,15.3 10.92,16.51 10.99,16.51 | 10.99,16.51 10.99,16.33 13.63,16.33 14.39,15.57 v14.62,15.57 | 10.99,16.51 v10.99,17.16 10.22,17.16 9.72,17.66 9.72,18.59 9.32,18.99 8.13,18.99 7.18,18.03 6.4,18.03 v6.13,17.77 6.13,16.3 6.71,15.73 6.71,15.14 6.49,14.93 X6.B4A9
  Bottom 0.254: IC1.7 11.46,16.99 | 11.46,16.99 11.8,17.34 R7.2 | v10.99,17.16 11.29,17.16 11.46,16.99 | D1.A 14.36,15.31 v14.62,15.57 | v6.13,17.77 6.13,17.44 C11.1
VBUS_DETECT
  Bottom 0.152: IC1.8 11.34,15.93 11.51,16.09 11.65,16.09 R7.1 12.65,16.32 R4.2

### Text on the board
bPlace: VBat